# EAGLE design LM35_Remote (EAGLE 7.2.0)
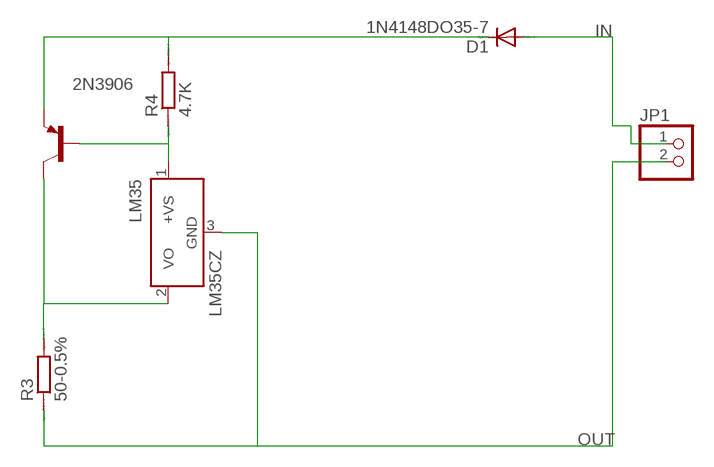
[diagram p0: schematic, sheet 1]

## Parts
2N3906  2N3906-PNP-TO92-EBC  [TO92-EBC]
D1  1N4148DO35-7  [DO35-7]
JP1  PINHD-1X2  [1X02]
LM35  LM35CZ  [TO92]
R3  50-0.5%  R-EU_0207_7  [0207/7]
R4  4.7K  R-EU_0207_7  [0207/7]

## Nets
IN: D1.A JP1.1
N$1: 2N3906.B LM35.1(+VS) R4.1
N$2: 2N3906.C LM35.2(VO) R3.2
N$3: 2N3906.E D1.C R4.2
OUT: JP1.2 LM35.3(GND) R3.1

## Library data of the parts
2N3906 = transistor-neu-to92:*-PNP-: PNP Transistror
D1 = diode:1N4148: DIODE high speed (Philips)
JP1 = pinhead:PINHD-1X2: PIN HEADER
LM35 = lm35:LM35: Single-Supply Centigrade Temperature Sensor Vout = (10mV/°C x Temp °C) +5mmmV Source: http://www.national.com/ds/LM/LM35.pdf
R3 R4 = resistor:R-EU_: RESISTOR, European symbol; SPICEPREFIX: R

## Board
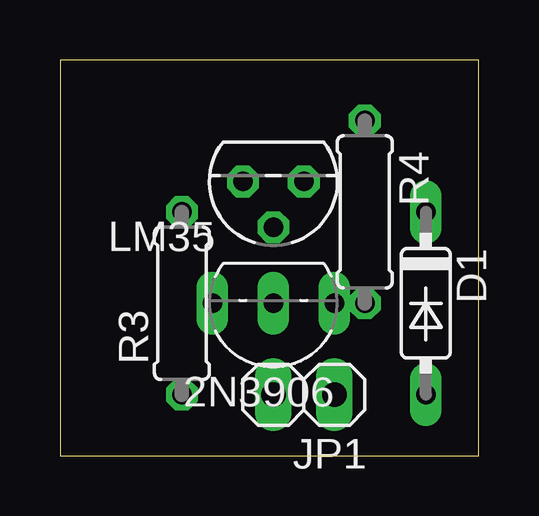
[diagram p1: board, top side]
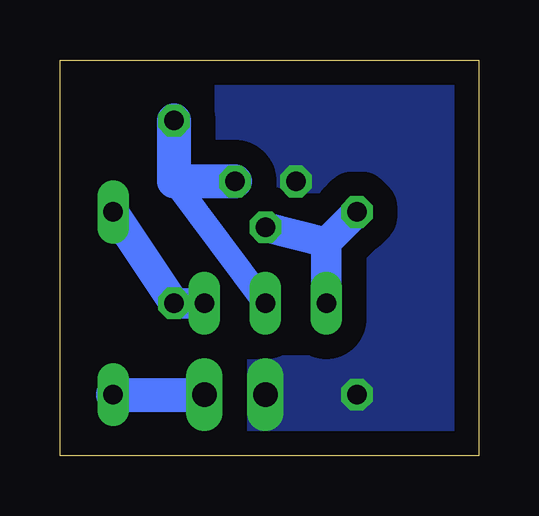
[diagram p2: board, bottom side, seen from below]

Size 17.45 x 16.5 mm. Coordinates in mm from the lower left corner, seen from the top.
Outline: 0,0 17.45,0 17.45,16.5 0,16.5 0,0
Copper layers (1*16): Top 0.035mm / dielectric 1.5mm / Bottom 0.035mm
Design rules "default": minimum track width 10mil, minimum drill 24mil, track to track 8mil, track to pad 8mil, pad to pad 8mil, via to via 8mil, smd to smd 8mil, copper to edge 40mil, drill to drill 8mil, minimum pad ring 10mil, minimum via ring 8mil, stop-mask expansion 4mil, vias tented up to drill 0mil, thermal gap 10mil

### Footprints (pad centres in the part's own frame; a part is rotated, then mirrored left to right if it is on the bottom)
TO92-EBC = drill 0.813 long: B 0,-1.27; C 2.54,-1.27; E -2.54,-1.27
DO35-7 = drill 0.813 long: A 3.81,0; C -3.81,0
1X02 = drill 1.016 long: 1 -1.27,0; 2 1.27,0
TO92 = drill 0.813 octagon: 1 -1.27,0; 2 0,1.905; 3 1.27,0
0207/7 = drill 0.813 octagon: 1 -3.81,0; 2 3.81,0

### Placement (x,y rotation side)
2N3906  8.89,5.08 180 top
D1  15.24,6.35 270 top
JP1  10.16,2.54 180 top
LM35  8.89,11.43 180 top
R3  5.08,6.35 90 top
R4  12.7,10.16 270 top

### Tracks (layer width: path | path; a pad name or v marks a point on that pad's centre or on a via)
IN
  Bottom 1.422: D1.A JP1.1
N$1
  Bottom 1.016: 2N3906.B 12.7,11.43
  Bottom 1.422: LM35.1 12.7,11.43 R4.1
N$2
  Bottom 1.27: 2N3906.C 6.35,8.89 | 6.35,8.89 R3.2 | LM35.2 6.35,8.89
N$3
  Bottom 1.27: 2N3906.E R4.2 D1.C
OUT
  pour Bottom (isolate 1.016, no thermals): 0,16.51 17.78,16.51 16.51,0 0,0